# EAGLE design Ambi-Light (EAGLE 6.6.0)
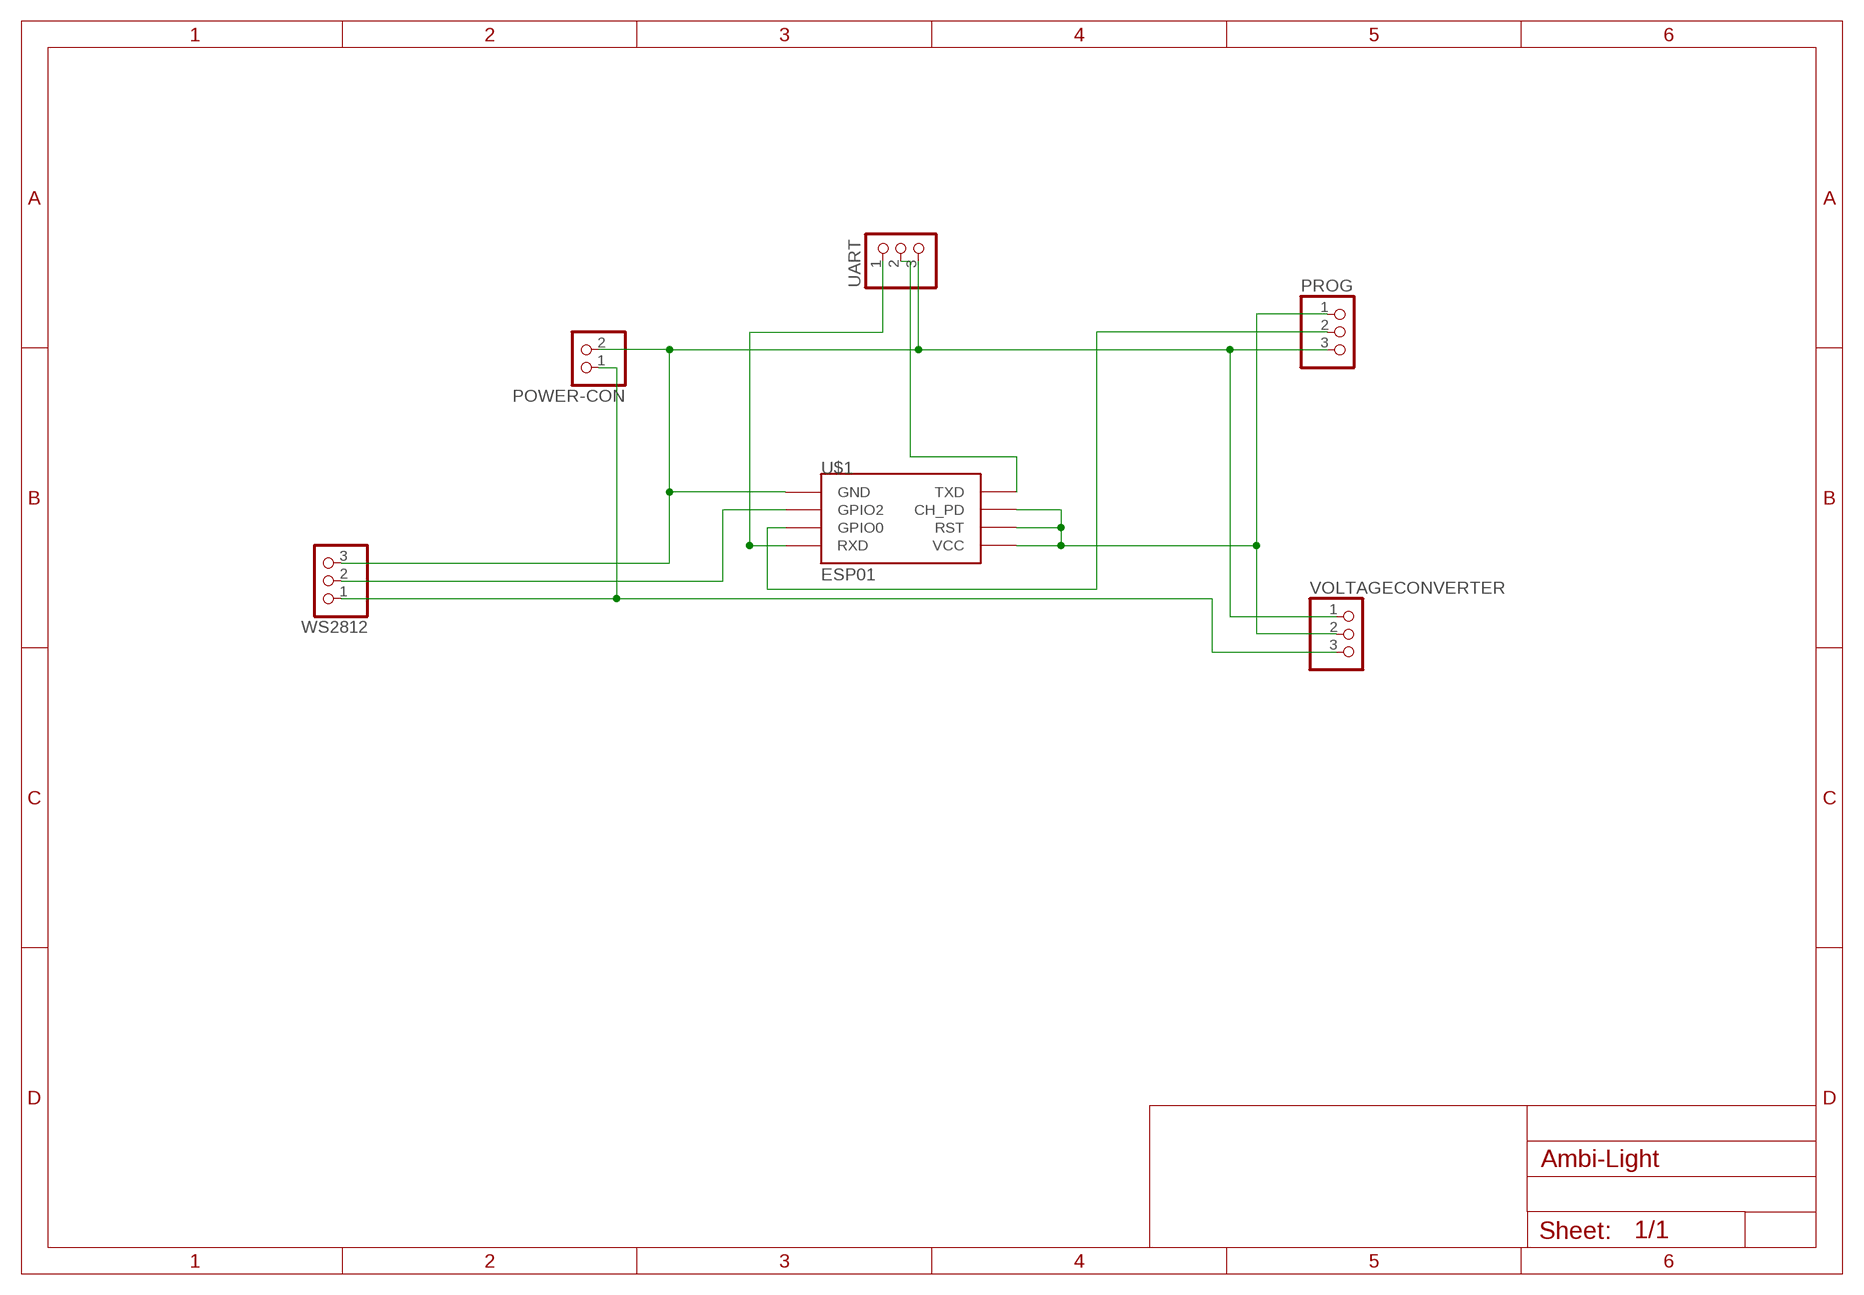
[diagram p0: schematic, sheet 1]

## Parts
POWER-CON  PINHD-1X2  [1X02]
PROG  PINHD-1X3  [1X03]
U$1  ESP01  [ESP01]
UART  PINHD-1X3  [1X03]
VOLTAGECONVERTER  PINHD-1X3  [1X03]
WS2812  PINHD-1X3  [1X03]

## Nets
GND: POWER-CON.2 PROG.3 U$1.GND UART.3 VOLTAGECONVERTER.1 WS2812.3
GPIO0: PROG.2 U$1.GPIO0
GPIO2: U$1.GPIO2 WS2812.2
RXD: U$1.RX(RXD) UART.1
TXD: U$1.TX(TXD) UART.2
VCC33: PROG.1 U$1.CH_PD U$1.RST U$1.VCC VOLTAGECONVERTER.2
VCC50: POWER-CON.1 VOLTAGECONVERTER.3 WS2812.1

## Library data of the parts
POWER-CON = pinhead:PINHD-1X2: PIN HEADER
PROG UART VOLTAGECONVERTER WS2812 = pinhead:PINHD-1X3: PIN HEADER
U$1 = esp8266modules:ESP01: ESP8266 Wifi module 01

## Board
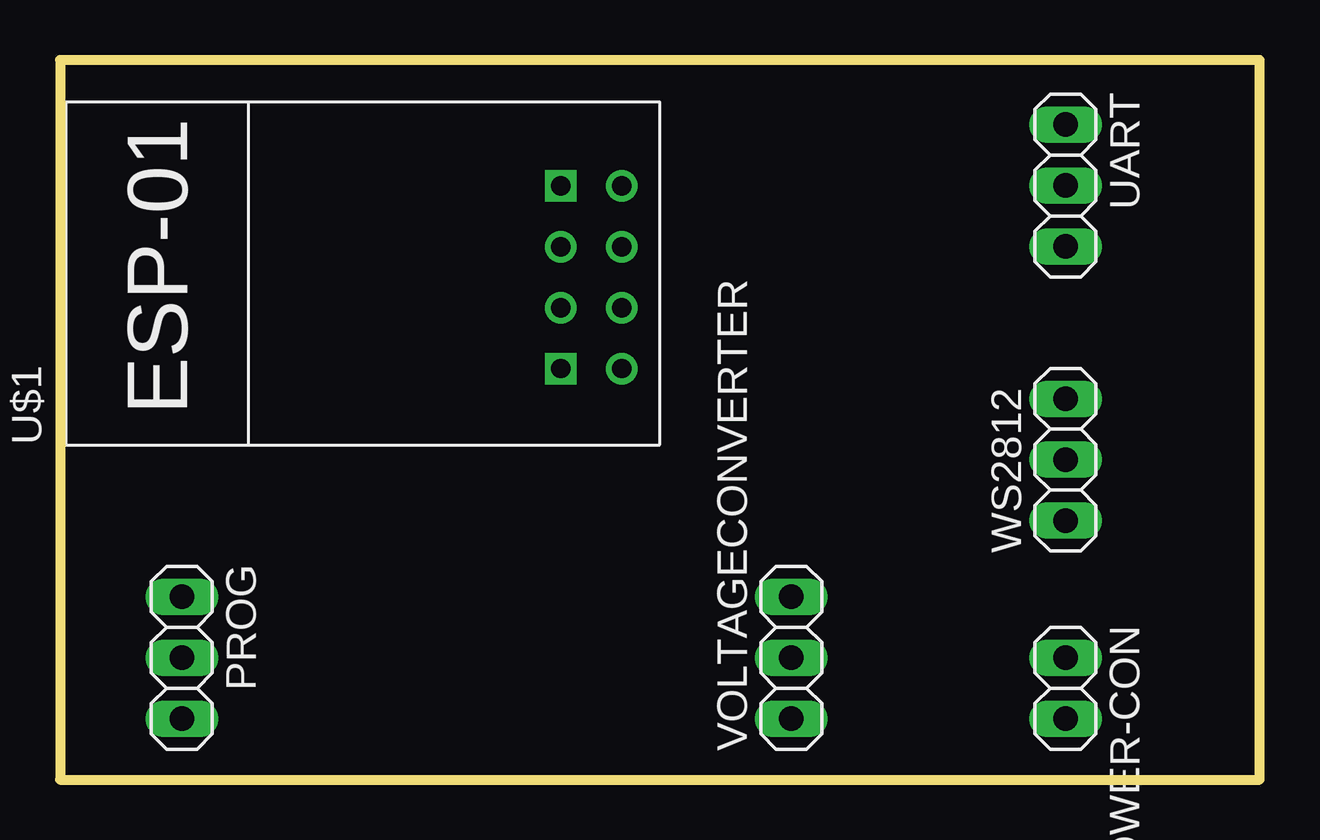
[diagram p1: board, top side]
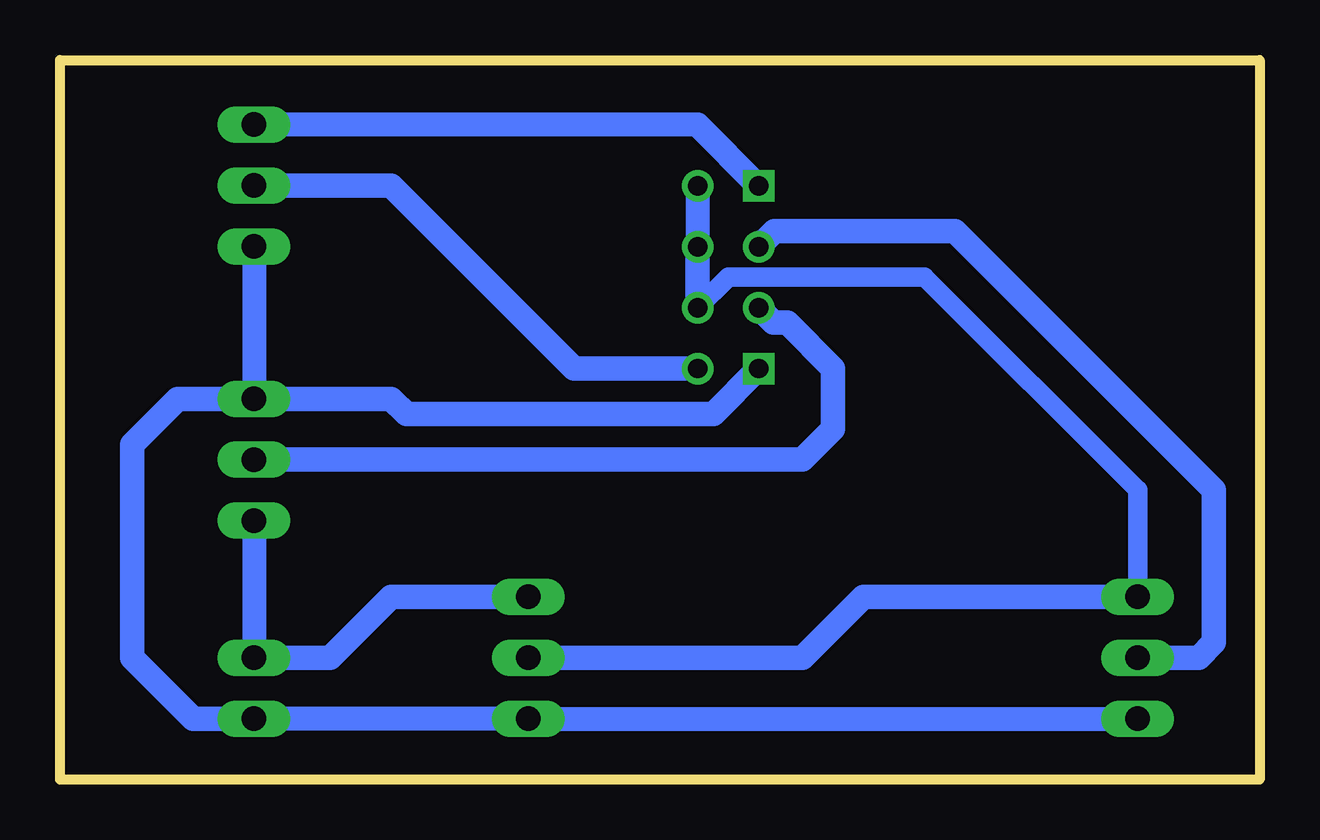
[diagram p2: board, bottom side, seen from below]

Size 50 x 30 mm. Coordinates in mm from the lower left corner, seen from the top.
Outline: 0,0 50,0 50,30 0,30 0,0
Copper layers (1*16): Top 0.035mm / dielectric 1.5mm / Bottom 0.035mm
Design rules "default *": minimum track width 12mil, minimum drill 24mil, track to track 8mil, track to pad 8mil, pad to pad 8mil, via to via 8mil, smd to smd 8mil, copper to edge 40mil, drill to drill 8mil, minimum pad ring 10mil, minimum via ring 8mil, stop-mask expansion 4mil, vias tented up to drill 0mil, thermal gap 10mil

### Footprints (pad centres in the part's own frame; a part is rotated, then mirrored left to right if it is on the bottom)
1X02 = drill 1.016 long: 1 -1.27,0; 2 1.27,0
1X03 = drill 1.016 long: 1 -2.54,0; 2 0,0; 3 2.54,0
ESP01 = drill 0.8: CH_PD -1.285,-8.178; GPIO0 1.255,-5.638; GPIO2 -1.285,-5.638; RST 1.255,-8.178; TX -3.825,-8.178; VCC 3.795,-8.178 | drill 0.8 square: GND -3.825,-5.638; RX 3.795,-5.638

### Placement (x,y rotation side)
POWER-CON  41.91,3.81 270 top
PROG  5.08,5.08 270 top
U$1  15.24,20.95 90 top
UART  41.91,24.77 270 top
VOLTAGECONVERTER  30.48,5.08 90 top
WS2812  41.91,13.34 90 top

### Tracks (layer width: path | path; a pad name or v marks a point on that pad's centre or on a via)
GND
  Bottom 1: PROG.3 VOLTAGECONVERTER.1 POWER-CON.2 | UART.3 WS2812.3
  Bottom 1.016: POWER-CON.2 44.45,2.54 46.99,5.08 46.99,13.97 45.09,15.88 WS2812.3 36.2,15.88 35.56,15.24 22.77,15.24 U$1.GND
GPIO0
  Bottom 1.016: PROG.2 2.54,5.08 1.91,5.71 1.91,12.06 12.7,22.86 20.23,22.86 U$1.GPIO0
GPIO2
  Bottom 1.016: U$1.GPIO2 20.26,19.05 19.68,19.05 17.78,17.14 17.78,14.61 19.05,13.34 WS2812.2
RXD
  Bottom 1: 23.42,27.3 UART.1
  Bottom 1.016: U$1.RX 23.42,27.3
TXD
  Bottom 1.016: UART.2 36.2,24.77 28.57,17.14 23.43,17.14 U$1.TX
VCC33
  Bottom 0.813: U$1.CH_PD 22.13,20.95 13.97,20.95 5.08,12.06 PROG.1
  Bottom 1: U$1.VCC U$1.RST
  Bottom 1.016: VOLTAGECONVERTER.2 19.05,5.08 16.51,7.62 PROG.1 | U$1.RST U$1.CH_PD
VCC50
  Bottom 1: WS2812.1 POWER-CON.1
  Bottom 1.016: POWER-CON.1 38.73,5.08 36.2,7.62 VOLTAGECONVERTER.3